# EAGLE design H3_MIDIController_Rev_3_PZBoard (EAGLE 7.6.0)
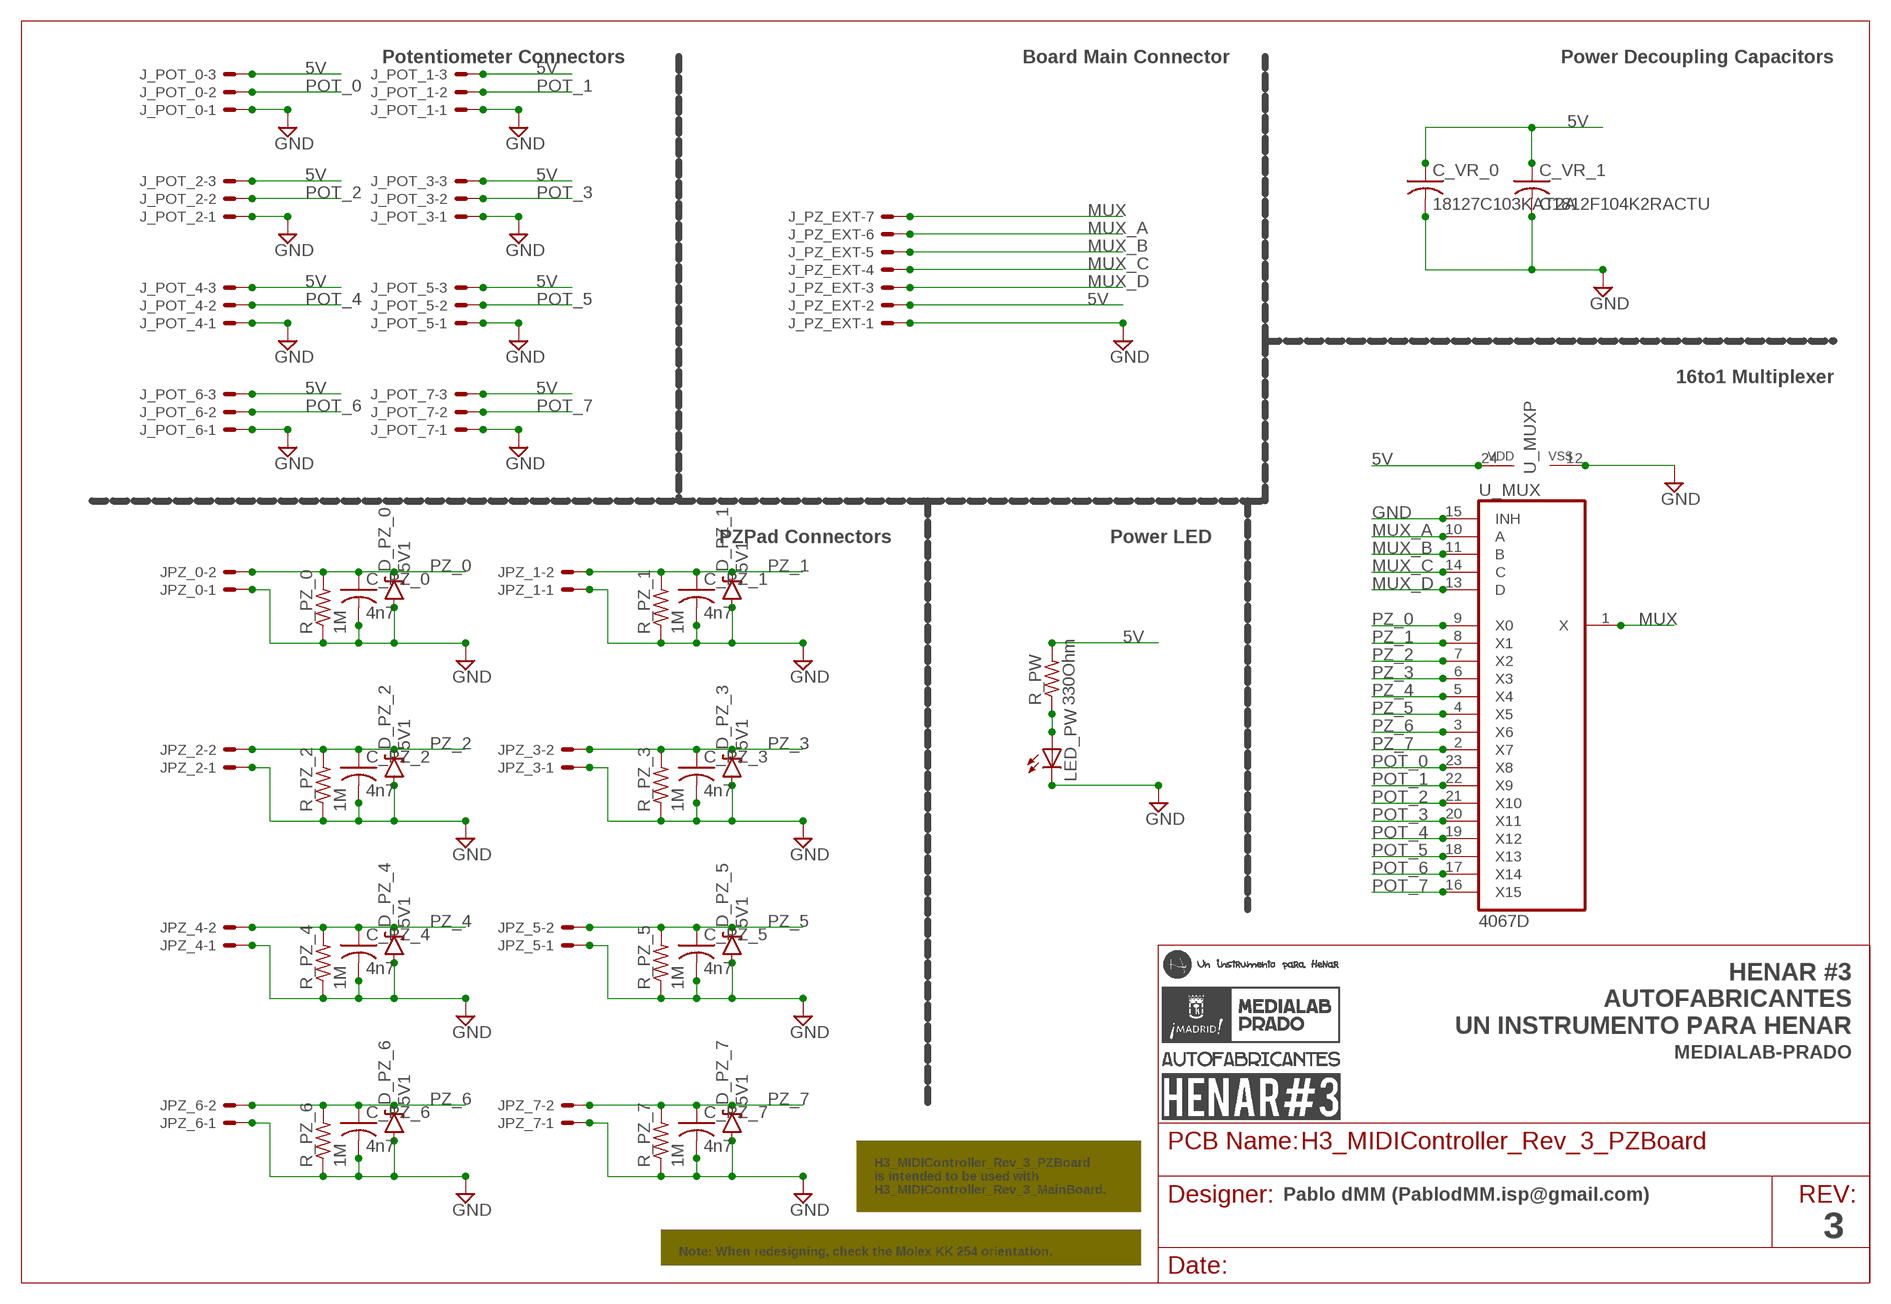
[diagram p0: schematic, sheet 1]

## Parts
C_PZ_0  4n7  C-USC1206  [C1206]
C_PZ_1  4n7  C-USC1206  [C1206]
C_PZ_2  4n7  C-USC1206  [C1206]
C_PZ_3  4n7  C-USC1206  [C1206]
C_PZ_4  4n7  C-USC1206  [C1206]
C_PZ_5  4n7  C-USC1206  [C1206]
C_PZ_6  4n7  C-USC1206  [C1206]
C_PZ_7  4n7  C-USC1206  [C1206]
C_VR_0  18127C103KAT2A  C-USC1812K  [C1812K]
C_VR_1  C1812F104K2RACTU  C-USC1812K  [C1812K]
D_PZ_0  5V1  DIODE-ZENER  [DIODE-BZT52]
D_PZ_1  5V1  DIODE-ZENER  [DIODE-BZT52]
D_PZ_2  5V1  DIODE-ZENER  [DIODE-BZT52]
D_PZ_3  5V1  DIODE-ZENER  [DIODE-BZT52]
D_PZ_4  5V1  DIODE-ZENER  [DIODE-BZT52]
D_PZ_5  5V1  DIODE-ZENER  [DIODE-BZT52]
D_PZ_6  5V1  DIODE-ZENER  [DIODE-BZT52]
D_PZ_7  5V1  DIODE-ZENER  [DIODE-BZT52]
J_POT_0  22-05-7038-03  [7395-03]
J_POT_1  22-05-7038-03  [7395-03]
J_POT_2  22-05-7038-03  [7395-03]
J_POT_3  22-05-7038-03  [7395-03]
J_POT_4  22-05-7038-03  [7395-03]
J_POT_5  22-05-7038-03  [7395-03]
J_POT_6  22-05-7038-03  [7395-03]
J_POT_7  22-05-7038-03  [7395-03]
J_PZ_EXT  22-05-7078-07  [7395-07]
JPZ_0  22-05-7028-02  [7395-02]
JPZ_1  22-05-7028-02  [7395-02]
JPZ_2  22-05-7028-02  [7395-02]
JPZ_3  22-05-7028-02  [7395-02]
JPZ_4  22-05-7028-02  [7395-02]
JPZ_5  22-05-7028-02  [7395-02]
JPZ_6  22-05-7028-02  [7395-02]
JPZ_7  22-05-7028-02  [7395-02]
LED_PW  LEDSMT1206  [1206]
R_PW  330Ohm  R-US_M1206  [M1206]
R_PZ_0  1M  R-US_M1206  [M1206]
R_PZ_1  1M  R-US_M1206  [M1206]
R_PZ_2  1M  R-US_M1206  [M1206]
R_PZ_3  1M  R-US_M1206  [M1206]
R_PZ_4  1M  R-US_M1206  [M1206]
R_PZ_5  1M  R-US_M1206  [M1206]
R_PZ_6  1M  R-US_M1206  [M1206]
R_PZ_7  1M  R-US_M1206  [M1206]
U_MUX  4067D  [SO24W]

## Nets
5V: C_VR_0.1 C_VR_1.1 J_POT_0.3 J_POT_1.3 J_POT_2.3 J_POT_3.3 J_POT_4.3 J_POT_5.3 J_POT_6.3 J_POT_7.3 J_PZ_EXT.2 R_PW.2 U_MUX.24(VDD)
GND: C_PZ_0.2 C_PZ_1.2 C_PZ_2.2 C_PZ_3.2 C_PZ_4.2 C_PZ_5.2 C_PZ_6.2 C_PZ_7.2 C_VR_0.2 C_VR_1.2 D_PZ_0.A D_PZ_1.A D_PZ_2.A D_PZ_3.A D_PZ_4.A D_PZ_5.A D_PZ_6.A D_PZ_7.A J_POT_0.1 J_POT_1.1 J_POT_2.1 J_POT_3.1 J_POT_4.1 J_POT_5.1 J_POT_6.1 J_POT_7.1 J_PZ_EXT.1 JPZ_0.1 JPZ_1.1 JPZ_2.1 JPZ_3.1 JPZ_4.1 JPZ_5.1 JPZ_6.1 JPZ_7.1 LED_PW.C R_PZ_0.1 R_PZ_1.1 R_PZ_2.1 R_PZ_3.1 R_PZ_4.1 R_PZ_5.1 R_PZ_6.1 R_PZ_7.1 U_MUX.12(VSS) U_MUX.15(INH)
MUX: J_PZ_EXT.7 U_MUX.1(X)
MUX_A: J_PZ_EXT.6 U_MUX.10(A)
MUX_B: J_PZ_EXT.5 U_MUX.11(B)
MUX_C: J_PZ_EXT.4 U_MUX.14(C)
MUX_D: J_PZ_EXT.3 U_MUX.13(D)
N$2: LED_PW.A R_PW.1
POT_0: J_POT_0.2 U_MUX.23(X8)
POT_1: J_POT_1.2 U_MUX.22(X9)
POT_2: J_POT_2.2 U_MUX.21(X10)
POT_3: J_POT_3.2 U_MUX.20(X11)
POT_4: J_POT_4.2 U_MUX.19(X12)
POT_5: J_POT_5.2 U_MUX.18(X13)
POT_6: J_POT_6.2 U_MUX.17(X14)
POT_7: J_POT_7.2 U_MUX.16(X15)
PZ_0: C_PZ_0.1 D_PZ_0.C JPZ_0.2 R_PZ_0.2 U_MUX.9(X0)
PZ_1: C_PZ_1.1 D_PZ_1.C JPZ_1.2 R_PZ_1.2 U_MUX.8(X1)
PZ_2: C_PZ_2.1 D_PZ_2.C JPZ_2.2 R_PZ_2.2 U_MUX.7(X2)
PZ_3: C_PZ_3.1 D_PZ_3.C JPZ_3.2 R_PZ_3.2 U_MUX.6(X3)
PZ_4: C_PZ_4.1 D_PZ_4.C JPZ_4.2 R_PZ_4.2 U_MUX.5(X4)
PZ_5: C_PZ_5.1 D_PZ_5.C JPZ_5.2 R_PZ_5.2 U_MUX.4(X5)
PZ_6: C_PZ_6.1 D_PZ_6.C JPZ_6.2 R_PZ_6.2 U_MUX.3(X6)
PZ_7: C_PZ_7.1 D_PZ_7.C JPZ_7.2 R_PZ_7.2 U_MUX.2(X7)

## Notes on the sheet
- Potentiometer Connectors | Board Main Connector | Power Decoupling Capacitors
- 16to1 Multiplexer
- PZPad Connectors | Power LED
- HENAR #3
  AUTOFABRICANTES
  UN INSTRUMENTO PARA HENAR
- MEDIALAB-PRADO
- H3_MIDIController_Rev_3_PZBoard
  is intended to be used with
  H3_MIDIController_Rev_3_MainBoard.
- Pablo dMM (PablodMM.isp@gmail.com)
- 3
- Note: When redesigning, check the Molex KK 254 orientation.

## Library data of the parts
C_PZ_0 C_PZ_1-C_PZ_7 C_VR_0 C_VR_1 = adafruit:C-US: CAPACITOR, American symbol
D_PZ_0 D_PZ_1-D_PZ_7 = SparkFun-DiscreteSemi:DIODE-ZENER: Zener Diode Production Part - 8199 3.4V Zener Voltage; PROD-ID: DIO-08199; VALUE: BZT52
J_POT_0 J_POT_1-J_POT_7 = con-molex:22-?-03: CONNECTOR wire to board 2.54 mm (.1 inch) pitch header; OC_FARNELL: unknown; OC_NEWARK: unknown
J_PZ_EXT = con-molex:22-?-07: CONNECTOR wire to board 2.54 mm (.1 inch) pitch header; OC_FARNELL: unknown; OC_NEWARK: unknown
JPZ_0 JPZ_1-JPZ_7 = con-molex:22-?-02: CONNECTOR wire to board 2.54 mm (.1 inch) pitch header; OC_FARNELL: 9731601; OC_NEWARK: unknown
LED_PW = adafruit:LED: LED OSRAM: - CHIPLED LG R971, LG N971, LY N971, LG Q971, LY Q971, LO R971, LY R971 LH N974, LH R974 LS Q976, LO Q976, LY Q976 LO Q996 - Hyper CHIPLED LW Q18S LB Q993, LB Q99A, LB R99A - SideLED LS A670, LO A670, LY A670, LG A670, LP A670 LB A673, LV A673, LT A673, LW A673 LH A674 LY A675 LS A676, LA A676, LO A676, LY A676, LW A676 LS A679, LY A679, LG A679 - Hyper Micro SIDELED® LS Y876, LA Y876, LO Y876, LY Y876 LT Y87S - SmartLED LW L88C, LW L88S LB L89C, LB L89S, LG L890 LS L89K, LO L89K, LY L89K LS L896, LA L896, LO L896, LY L896 - TOPLED LS T670, LO T670, LY T670, LG T670, LP T670 LSG T670, LSP T670, LSY T670, LOP T670, LYG T670 LG T671, LOG T671, LSG T671 LB T673, LV T673, LT T673, LW T673 LH T674 LS T676, LA T676, LO T676, LY T676, LB T676, LH T676, LSB T676, LW T676 LB T67C, LV T67C, LT T67C, LS T67K, LO T67K, LY T67K, LW E67C LS E67B, LA E67B, LO E67B, LY E67B, LB E67C, LV E67C, LT E67C LW T67C LS T679, LY T679, LG T679 LS T770, LO T770, LY T770, LG T770, LP T770 LB T773, LV T773, LT T773, LW T773 LH T774 LS E675, LA E675, LY E675, LS T675 LS T776, LA T776, LO T776, LY T776, LB T776 LHGB T686 LT T68C, LB T68C - Hyper Mini TOPLED® LB M676 - Mini TOPLED Santana® LG M470 LS M47K, LO M47K, LY M47K Source: http://www.osram.convergy.de/
R_PW R_PZ_0 R_PZ_1-R_PZ_7 = adafruit:R-US_: RESISTOR, American symbol
U_MUX = 40xx:4067: 16-channel ANALOG MULTIPLEXER

## Net classes
1 GND: width 0.635 mm

## Board
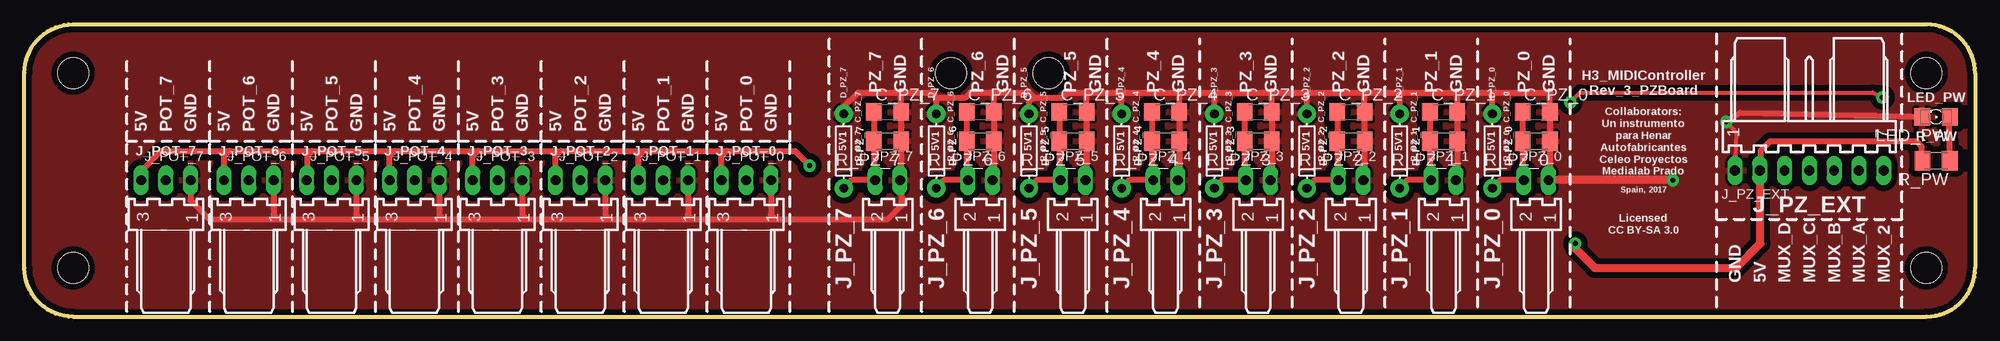
[diagram p1: board, top side]
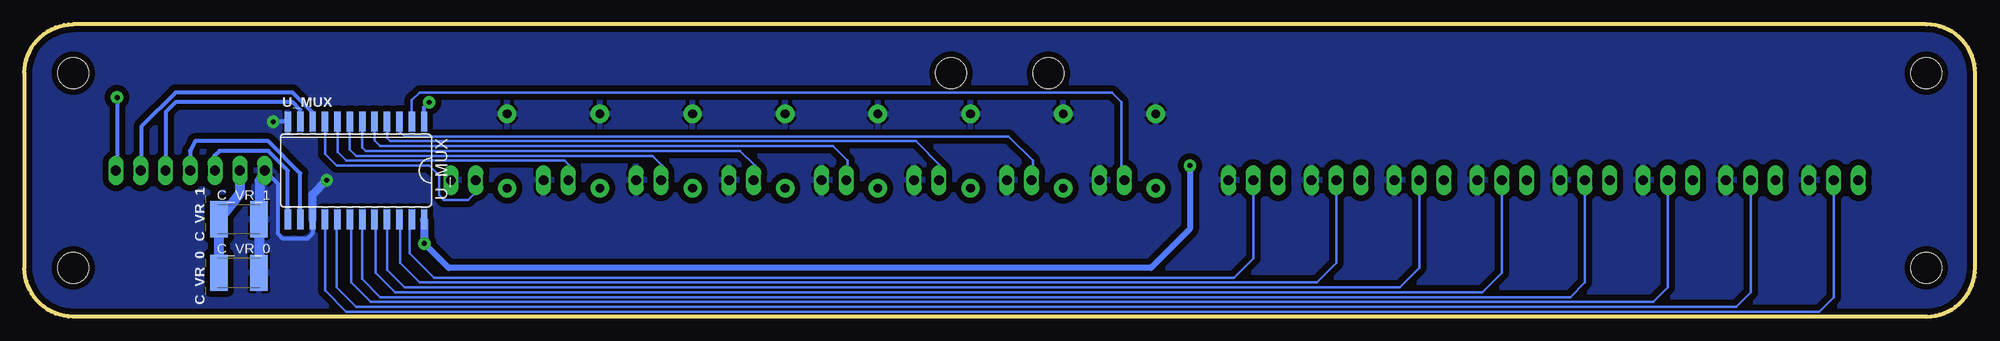
[diagram p2: board, bottom side, seen from below]

Size 200 x 30 mm. Coordinates in mm from the lower left corner, seen from the top.
Outline: 5,0 195,0 arc90 200,5 200,25 arc90 195,30 5,30 arc90 0,25 0,5 arc90 5,0
Copper layers (1*16): Top 0.035mm / dielectric 1.5mm / Bottom 0.035mm
Design rules "default *": minimum track width 12mil, minimum drill 25mil, track to track 15mil, track to pad 15mil, pad to pad 15mil, via to via 15mil, smd to smd 8mil, copper to edge 20mil, drill to drill 8mil, minimum pad ring 10mil, minimum via ring 15mil, stop-mask expansion 4mil, vias tented up to drill 0mil, thermal gap 10mil
Holes 3.2 mm at 5,25 5,5 195,25 195,5 105,25 95,25

### Footprints (pad centres in the part's own frame; a part is rotated, then mirrored left to right if it is on the bottom)
C1206 = smd 1.6 x 1.8: 1 -1.4,0; 2 1.4,0
C1812K = smd 1.8 x 3.7: 1 -2.05,0; 2 2.05,0
DIODE-BZT52 = drill 0.9 pad 1.88: A -3.81,0; C 3.81,0
7395-03 = drill 1.016 long: 1 2.54,0; 2 0,0; 3 -2.54,0
7395-07 = drill 1.016 long: 1 7.62,0; 2 5.08,0; 3 2.54,0; 4 0,0; 5 -2.54,0; 6 -5.08,0; 7 -7.62,0
7395-02 = drill 1.016 long: 1 1.27,0; 2 -1.27,0
1206 = smd 1.6 x 1.803: A -1.422,0; C 1.422,0
M1206 = smd 1.6 x 2: 1 -1.4,0; 2 1.4,0
SO24W = smd 0.66 x 2.032: 1 -6.985,-5.029; 2 -5.715,-5.029; 3 -4.445,-5.029; 4 -3.175,-5.029; 5 -1.905,-5.029; 6 -0.635,-5.029; 7 0.635,-5.029; 8 1.905,-5.029; 9 3.175,-5.029; 10 4.445,-5.029; 11 5.715,-5.029; 12 6.985,-5.029; 13 6.985,5.029; 14 5.715,5.029; 15 4.445,5.029; 16 3.175,5.029; 17 1.905,5.029; 18 0.635,5.029; 19 -0.635,5.029; 20 -1.905,5.029; 21 -3.175,5.029; 22 -4.445,5.029; 23 -5.715,5.029; 24 -6.985,5.029

### Placement (x,y rotation side)
C_PZ_0  155,21 0 top
C_PZ_1  145.5,21 0 top
C_PZ_2  136,21 0 top
C_PZ_3  126.5,21 0 top
C_PZ_4  117,21 0 top
C_PZ_5  107.5,21 0 top
C_PZ_6  98,21 0 top
C_PZ_7  88.5,21 0 top
C_VR_0  178,4.5 0 bottom
C_VR_1  178,10 0 bottom
D_PZ_0  150.5,17 270 top
D_PZ_1  141,17 270 top
D_PZ_2  131.5,17 270 top
D_PZ_3  122,17 270 top
D_PZ_4  112.5,17 270 top
D_PZ_5  103,17 270 top
D_PZ_6  93.5,17 270 top
D_PZ_7  84,17 270 top
J_POT_0  74,14 0 top
J_POT_1  65.5,14 0 top
J_POT_2  57,14 0 top
J_POT_3  48.5,14 0 top
J_POT_4  40,14 0 top
J_POT_5  31.5,14 0 top
J_POT_6  23,14 0 top
J_POT_7  14.5,14 0 top
J_PZ_EXT  183,15 180 top
JPZ_0  155,14 0 top
JPZ_1  145.5,14 0 top
JPZ_2  136,14 0 top
JPZ_3  126.5,14 0 top
JPZ_4  117,14 0 top
JPZ_5  107.5,14 0 top
JPZ_6  98,14 0 top
JPZ_7  88.5,14 0 top
LED_PW  196,20.5 180 top
R_PW  196,16 180 top
R_PZ_0  155,18 180 top
R_PZ_1  145.5,18 180 top
R_PZ_2  136,18 180 top
R_PZ_3  126.5,18 180 top
R_PZ_4  117,18 180 top
R_PZ_5  107.5,18 180 top
R_PZ_6  98,18 180 top
R_PZ_7  88.5,18 180 top
U_MUX  166,15 180 bottom

### Tracks (layer width: path | path; a pad name or v marks a point on that pad's centre or on a via)
5V  (via drill 0.5)
  Top 0.61: J_POT_7.3 11.96,14.96 14,17 21,17 | 29.5,17 38,17 | 38,17 46.5,17 | 46.5,17 55,17 | 55,17 63.5,17 | 63.5,17 72,17 | 72,17 79,17 v80.5,15.5 | J_POT_6.3 20.46,16.46 21,17 | 21,17 29.5,17 | 29.5,17 29,16.5 29,14.04 J_POT_5.3 | J_POT_4.3 37.46,16.46 38,17 | J_POT_1.3 62.96,16.46 63.5,17 | J_POT_0.3 71.46,16.46 72,17 | J_POT_2.3 54.46,16.46 55,17 | J_POT_3.3 45.96,16.46 46.5,17 | J_PZ_EXT.2 178,15.08 178,17 179,18 194,18 194.5,17.5 194.5,16.1 R_PW.2
  Top 0.813: v159,7.5 159,7 161,5 175.5,5 178,7.5 178,14.42 177.92,14.5 J_PZ_EXT.2
  Bottom 0.61: v80.5,15.5 80.5,9 84.5,5 156.5,5 v159,7.5
  Bottom 0.813: U_MUX.24 159.01,7.51 v159,7.5
  Bottom 1.016: J_PZ_EXT.2 177.92,12.63 C_VR_1.1 C_VR_0.1
GND  (via drill 0.5)
  Top 0.406: v174.5,20 175.5,18.88 J_PZ_EXT.1
  Top 0.61: J_POT_7.1 17.04,11.96 19,10 26,10 | 26,10 34.5,10 | 34.5,10 43,10 | 43,10 51.5,10 | 51.5,10 60,10 | 60,10 68.5,10 | 68.5,10 77,10 | J_POT_6.1 25.54,10.46 26,10 | J_POT_4.1 42.54,10.46 43,10 | J_POT_3.1 51.04,10.46 51.5,10 | J_POT_2.1 59.54,10.46 60,10 | J_POT_1.1 68.04,10.46 68.5,10 | JPZ_6.1 99.4,14.13 R_PZ_6.1 C_PZ_6.2 99.4,22.9 99.5,23 | JPZ_5.1 108.9,14.13 R_PZ_5.1 C_PZ_5.2 108.9,22.9 109,23 | JPZ_4.1 118.4,14.13 R_PZ_4.1 C_PZ_4.2 118.4,22.9 118.5,23 | JPZ_3.1 127.9,14.13 R_PZ_3.1 C_PZ_3.2 127.9,22.9 128,23 | JPZ_2.1 137.4,14.13 R_PZ_2.1 C_PZ_2.2 137.4,22.9 137.5,23 | JPZ_1.1 146.9,14.13 R_PZ_1.1 C_PZ_1.2 146.9,22.9 147,23 | JPZ_0.1 156.4,14.13 R_PZ_0.1 C_PZ_0.2 156.4,22.9 156.5,23 150.5,23 | D_PZ_7.A 84,21.5 85.5,23 90,23 | 90,23 93,23 93.5,22.5 | 93.5,22.5 96.5,22.5 97,23 99.5,23 | 99.5,23 103,23 103.5,22.5 | 103.5,22.5 106.5,22.5 107,23 109,23 | 109,23 112.5,23 | 112.5,23 118.5,23 | 118.5,23 122,23 | 122,23 128,23 | 128,23 131.5,23 | 131.5,23 137.5,23 | 137.5,23 141,23 | 141,23 147,23 | 147,23 150.5,23 | D_PZ_1.A 141,23 | D_PZ_0.A 150.5,23 | D_PZ_2.A 131.5,23 | D_PZ_3.A 122,23 | D_PZ_4.A 112.5,23 | 90,23 89.9,22.9 C_PZ_7.2 R_PZ_7.1 89.9,14.13 JPZ_7.1 90,13.77 90,11.5 88.5,10 77,10 | D_PZ_6.A 93.5,22.5 | D_PZ_5.A 103,22 103.5,22.5 | J_POT_0.1 76.54,10.46 77,10 | LED_PW.C 175.9,20.9 v174.5,20 | J_POT_5.1 34.04,10.46 34.5,10
  Top 0.813: v169,14 JPZ_0.1
  Bottom 0.406: U_MUX.12 174.47,20.03 v174.5,20 | U_MUX.15 170.44,8.55 171,8 173.5,8 174,8.5 174,13.62 J_PZ_EXT.1
  Bottom 0.813: U_MUX.15 170.44,12.55 v169,14
  Bottom 1.016: J_PZ_EXT.1 175.88,13.93 C_VR_1.2 C_VR_0.2
  pour Top (isolate 0.61): 5,0 195,0 arc90 200,5 200,25 arc90 195,30 5,30 arc90 0,25 0,5 arc90
  pour Bottom (isolate 0.61): 5,30 arc90 0,25 0,5 arc90 5,0 195,0 arc90 200,5 200,25 arc90 195,30
MUX  (via drill 0.5)
  Top 0.406: v158.5,22 159.5,23 189.5,23 v190.5,22.5
  Bottom 0.406: U_MUX.1 159.01,21.48 v158.5,22 | v190.5,22.5 190.5,15.12 J_PZ_EXT.7
MUX_A
  Bottom 0.406: U_MUX.10 170.44,20.95 172.5,23 184.5,23 188,19.5 188,16.08 J_PZ_EXT.6
MUX_B
  Bottom 0.406: U_MUX.11 171.72,21.21 172.5,22 184.5,22 185.5,21 185.5,17.04 J_PZ_EXT.5
MUX_C
  Bottom 0.406: U_MUX.14 171.72,14.71 175,18 182.5,18 183,17 J_PZ_EXT.4
MUX_D
  Bottom 0.406: U_MUX.13 172.99,14.98 175,17 180,17 180.5,16.54 J_PZ_EXT.3
N$1
  pour Top (isolate 0.61): 0,5 arc90 5,0 195,0 arc90 200,5 200,25 arc90 195,30 5,30 arc90 0,25
N$2
  Top 0.61: LED_PW.A 197.22,20.42 R_PW.1
N$3
  pour Bottom (isolate 0.61): 5,30 arc90 0,25 0,5 arc90 5,0 195,0 arc90 200,5 200,25 arc90 195,30
POT_0
  Bottom 0.254: J_POT_0.2 74,6 76,4 158,4 160.5,6.5 160.5,9.76 U_MUX.23
POT_1
  Bottom 0.254: J_POT_1.2 65.5,5.5 67.5,3.5 159.5,3.5 161.5,5.5 161.5,9.92 U_MUX.22
POT_2
  Bottom 0.254: U_MUX.21 162.82,4.83 161,3 59,3 57,5 J_POT_2.2
POT_3
  Bottom 0.254: J_POT_3.2 48.5,4.5 50.5,2.5 162,2.5 164,4.5 164,9.88 U_MUX.20
POT_4
  Bottom 0.254: U_MUX.19 165.37,3.87 163.5,2 41.5,2 40,3.5 J_POT_4.2
POT_5
  Bottom 0.254: J_POT_5.2 31.5,3 33,1.5 164.5,1.5 166.5,3.5 166.5,9.11 U_MUX.18
POT_6
  Bottom 0.254: J_POT_6.2 23,2.5 24.5,1 166,1 168,3 168,9.88 U_MUX.17
POT_7
  Bottom 0.254: U_MUX.16 169.18,2.67 167,0.5 16,0.5 14.5,2 J_POT_7.2
PZ_0
  Top 0.61: C_PZ_0.1 R_PZ_0.2 153.6,14.13 JPZ_0.2 151.31,14 D_PZ_0.C
  Bottom 0.254: U_MUX.9 169.18,16.68 168,15.5 158.5,15.5 157.5,14.5 157.5,12.5 157,12 154.5,12 153.5,13 153.5,13.77 JPZ_0.2 154,13.73
PZ_1
  Top 0.61: C_PZ_1.1 R_PZ_1.2 144.1,14.13 JPZ_1.2 141.81,14 D_PZ_1.C
  Bottom 0.254: U_MUX.8 167.91,16.91 167,16 144.6,16 144.1,15.5 144.1,14.13 JPZ_1.2
PZ_2
  Top 0.61: C_PZ_2.1 R_PZ_2.2 134.6,14.13 JPZ_2.2 132.31,14 D_PZ_2.C
  Bottom 0.254: U_MUX.7 166.63,17.14 166,16.5 135.6,16.5 134.6,15.5 134.6,14.13 JPZ_2.2
PZ_3
  Top 0.61: C_PZ_3.1 R_PZ_3.2 125.1,14.13 JPZ_3.2 122.81,14 D_PZ_3.C
  Bottom 0.254: U_MUX.6 165.37,17.36 165,17 126.6,17 125.1,15.5 125.1,14.13 JPZ_3.2
PZ_4
  Top 0.61: C_PZ_4.1 R_PZ_4.2 115.6,14.13 JPZ_4.2 113.31,14 D_PZ_4.C
  Bottom 0.254: U_MUX.5 164.09,18.09 163.5,17.5 117.1,17.5 115.6,16 115.6,14.13 JPZ_4.2
PZ_5
  Top 0.61: C_PZ_5.1 R_PZ_5.2 106.1,14.13 JPZ_5.2 103.81,14 D_PZ_5.C
  Bottom 0.254: U_MUX.4 162.82,18.32 162.5,18 108.6,18 106.1,15.5 106.1,14.13 JPZ_5.2
PZ_6
  Top 0.61: C_PZ_6.1 R_PZ_6.2 96.6,14.13 JPZ_6.2 94.31,14 D_PZ_6.C
  Bottom 0.254: U_MUX.3 161.56,19.05 161,18.5 99.1,18.5 96.6,16 96.6,14.13 JPZ_6.2
PZ_7
  Top 0.61: C_PZ_7.1 R_PZ_7.2 87.1,14.13 JPZ_7.2 84.81,14 D_PZ_7.C
  Bottom 0.254: U_MUX.2 160.28,22.21 159.5,23 88.5,23 87.5,22 87.5,14.27 JPZ_7.2

### Text on the board
t_Silk: D_PZ_7 | D_PZ_6 | D_PZ_5 | D_PZ_4 | D_PZ_3 | D_PZ_2 | D_PZ_1 | D_PZ_0 | H3_MIDIController / Rev_3_PZBoard | PZ_7 / GND | PZ_6 / GND | PZ_5 / GND | PZ_4 / GND | PZ_3 / GND | PZ_2 / GND | PZ_1 / GND | PZ_0 / GND | C_PZ_7 | C_PZ_6 | C_PZ_5 | C_PZ_4 | C_PZ_3 | C_PZ_2 | C_PZ_1 | C_PZ_0 | LED_PW | 5V / POT_7 / GND | 5V / POT_6 / GND | 5V / POT_5 / GND | 5V / POT_4 / GND | 5V / POT_3 / GND | 5V / POT_2 / GND | 5V / POT_1 / GND | 5V / POT_0 / GND | R_PZ_7 | R_PZ_6 | R_PZ_5 | R_PZ_4 | R_PZ_3 | R_PZ_2 | R_PZ_1 | R_PZ_0 | Collaborators: / Un instrumento / para Henar / Autofabricantes / Celeo Proyectos / Medialab Prado | R_PW | J_POT_7 | J_POT_6 | J_POT_5 | J_POT_4 | J_POT_3 | J_POT_2 | J_POT_1 | J_POT_0 | Spain, 2017 | J_PZ_EXT | Licensed / CC BY-SA 3.0 | J_PZ_7 | J_PZ_6 | J_PZ_5 | J_PZ_4 | J_PZ_3 | J_PZ_2 | J_PZ_1 | J_PZ_0 | GND / 5V / MUX_D / MUX_C / MUX_B / MUX_A / MUX_2
b_Silk: U_MUX | C_VR_1 | C_VR_0